# EAGLE schematic cansat_vehicle_v3_brd2 (EAGLE 7.1.0)
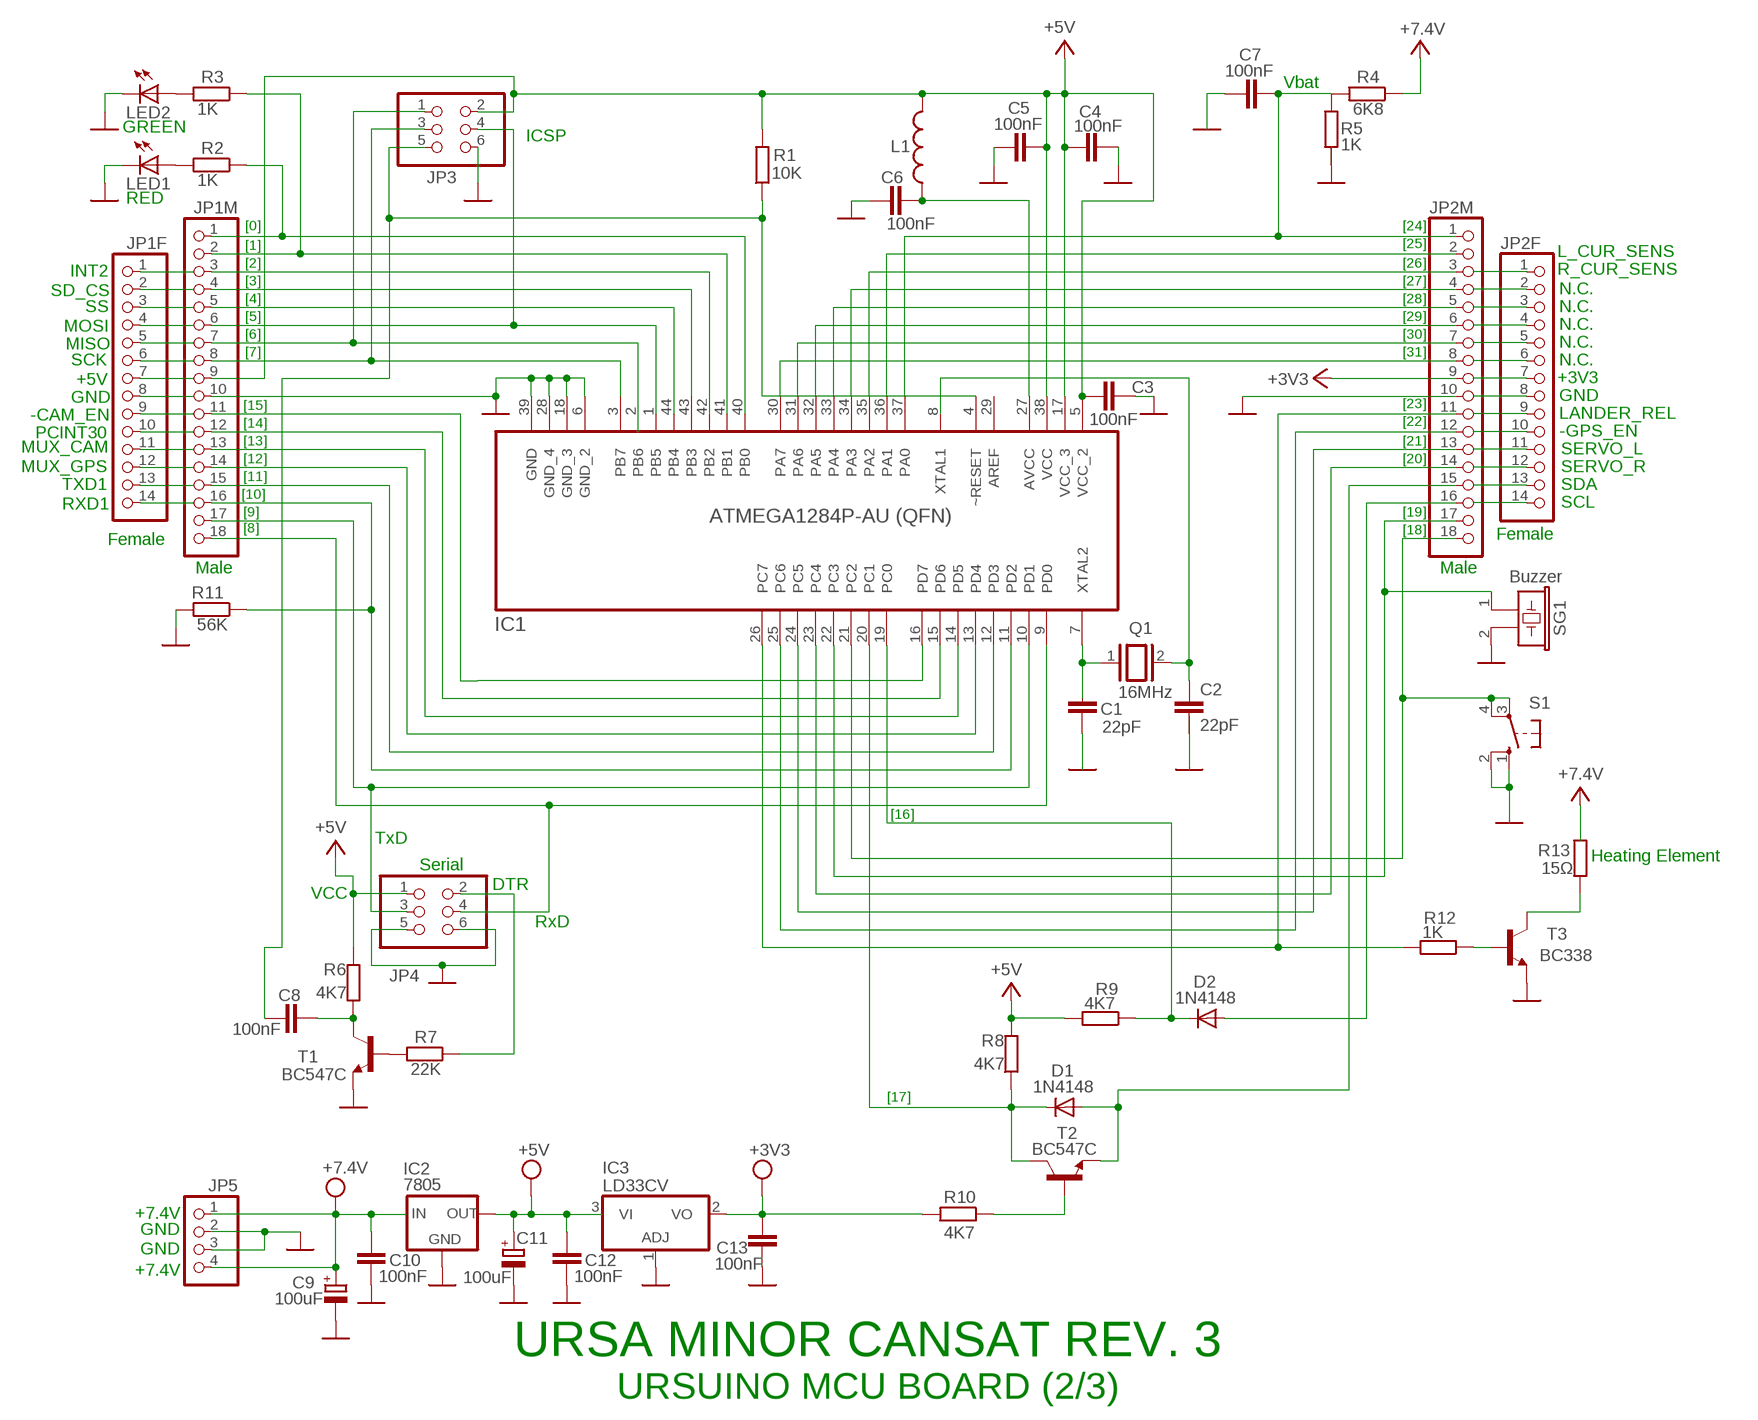
[diagram p0: schematic, sheet 1]

## Parts
C1  22pF  C2.5/2  [C2.5-2]
C2  22pF  C2.5/2  [C2.5-2]
C3  100nF  C2.5/2  [C2.5-2]
C4  100nF  C2.5/2  [C2.5-2]
C5  100nF  C2.5/2  [C2.5-2]
C6  100nF  C2.5/2  [C2.5-2]
C7  100nF  C2.5/2  [C2.5-2]
C8  100nF  C2.5/2  [C2.5-2]
C9  100uF  CPOL-EUE2.5-7  [E2,5-7]
C10  100nF  C2.5/2  [C2.5-2]
C11  100uF  CPOL-EUE2.5-7  [E2,5-7]
C12  100nF  C2.5/2  [C2.5-2]
C13  100nF  C2.5/2  [C2.5-2]
D1  1N4148  1N4148DO35-10  [DO35-10]
D2  1N4148  1N4148DO35-10  [DO35-10]
IC1  ATMEGA1284P-AU (QFN)  ATMEGA1284P-AU  [QFP80P1200X1200X120-44N]
IC2  7805  78XXL  [78XXL]
IC3  LD33CV  317T  [TO220H]
JP1F  PINHD-1X14  [1X14]
JP1M  PINHD-1X18  [1X18]
JP2F  PINHD-1X14  [1X14]
JP2M  PINHD-1X18  [1X18]
JP3  PINHD-2X3  [2X03]
JP4  PINHD-2X3  [2X03]
JP5  PINHD-1X4  [1X04]
L1  L-US0204/5  [0204/5]
LED1  LED3MM  [LED3MM]
LED2  LED3MM  [LED3MM]
Q1  16MHz  XTAL  [Q]
R1  10K  R-EU_0204_2V  [0204V]
R2  1K  R-EU_0204_2V  [0204V]
R3  1K  R-EU_0204_2V  [0204V]
R4  6K8  R-EU_0204_2V  [0204V]
R5  1K  R-EU_0204_2V  [0204V]
R6  4K7  R-EU_0204_2V  [0204V]
R7  22K  R-EU_0204_2V  [0204V]
R8  4K7  R-EU_0204_2V  [0204V]
R9  4K7  R-EU_0204_2V  [0204V]
R10  4K7  R-EU_0204_2V  [0204V]
R11  56K  R-EU_0204_2V  [0204V]
R12  1K  R-EU_0204_2V  [0204V]
R13  15Ω  R-EU_0204_2V  [0204V]
S1  10-XX  [B3F-10XX]
SG1  Buzzer  B/C11L  [B/C11L]
T1  BC547C  BC547B-NPN-TO92-CBE  [TO92-CBE]
T2  BC547C  BC547B-NPN-TO92-CBE  [TO92-CBE]
T3  BC338  BC547B-NPN-TO92-CBE  [TO92-CBE]

## Nets
GND: C1.2 C2.2 C3.2 C4.1 C5.2 C6.1 C9.- C10.2 C11.- C12.2 C13.2 IC1.6(GND_2) IC1.18(GND_3) IC1.28(GND_4) IC1.39(GND) IC2.GND IC3.1(ADJ) JP1M.10 JP2M.10 JP3.6 JP4.5 JP4.6 JP5.2 JP5.3 LED1.K(C) LED2.K(C) R5.1 R11.2 SG1.2 T1.E T3.E
N$1: C1.1 IC1.7(XTAL2) Q1.1
N$2: IC1.15(PD6) JP1M.12
N$4: IC1.14(PD5) JP1M.13
N$5: C2.1 IC1.8(XTAL1) Q1.2
N$6: R12.1 T3.B
N$7: R13.1 T3.C
N$49: IC1.40(PB0) JP1M.1 R2.1
N$50: IC1.41(PB1) JP1M.2 R3.1
N$51: IC1.42(PB2) JP1M.3
N$52: IC1.43(PB3) JP1M.4
N$53: IC1.44(PB4) JP1M.5
N$54: IC1.1(PB5) JP1M.6 JP3.4
N$55: IC1.2(PB6) JP1M.7 JP3.1
N$56: IC1.3(PB7) JP1M.8 JP3.3
N$57: IC1.16(PD7) JP1M.11
N$58: IC1.13(PD4) JP1M.14
N$59: IC1.12(PD3) JP1M.15
N$60: IC1.11(PD2) JP1M.16 R11.1
N$61: IC1.10(PD1) JP1M.17 JP4.3
N$62: R10.1 T2.B
N$63: C7.2
N$64: IC1.36(PA1) JP2M.2
N$65: IC1.35(PA2) JP2M.3
N$66: IC1.34(PA3) JP2M.4
N$67: IC1.33(PA4) JP2M.5
N$68: IC1.32(PA5) JP2M.6
N$69: IC1.31(PA6) JP2M.7
N$70: IC1.30(PA7) JP2M.8
N$71: IC1.21(PC2) JP2M.18 S1.3(P) S1.4(P1)
N$72: IC1.22(PC3) JP2M.17 SG1.1
N$73: D2.A JP2M.16
N$74: D1.C IC1.20(PC1) R8.1 T2.C
N$75: IC1.23(PC4) JP2M.14
N$76: IC1.24(PC5) JP2M.13
N$77: IC1.25(PC6) JP2M.12
N$78: IC1.26(PC7) JP2M.11 R12.2
N$79: JP1F.1
N$80: JP1F.2
N$81: JP1F.3
N$82: JP1F.4
N$83: JP1F.5
N$84: JP1F.6
N$85: JP1F.7
N$86: JP1F.8
N$87: JP1F.9
N$88: JP1F.10
N$89: JP1F.11
N$90: JP1F.12
N$91: JP1F.13
N$92: JP1F.14
N$93: JP2F.1
N$94: D1.A JP2M.15 T2.E
N$95: LED1.A R2.2
N$96: JP2F.2
N$97: D2.C IC1.19(PC0) R9.1
N$98: JP2F.3
N$99: JP2F.4
N$100: JP2F.5
N$101: JP2F.6
N$102: JP2F.7
N$103: JP2F.8
N$104: JP2F.9
N$105: JP2F.10
N$106: JP2F.11
N$107: JP2F.12
N$108: JP2F.13
N$109: JP2F.14
N$110: C6.2 IC1.27(AVCC) L1.1
N$111: C8.1 IC1.4(~RESET) JP3.5 R1.1
N$112: LED2.A R3.2
N$113: S1.1(S) S1.2(S1)
N$114: C7.1 IC1.37(PA0) JP2M.1 R4.2 R5.2
N$115: C8.2 R6.1 T1.C
N$116: R7.2 T1.B
N$117: JP4.2 R7.1
N$119: IC1.9(PD0) JP1M.18 JP4.4
VCC: C3.1 C4.2 C5.1 C9.+ C10.1 C11.+ C12.1 C13.1 IC1.5(VCC_2) IC1.17(VCC_3) IC1.38(VCC) IC2.IN IC2.OUT IC3.2(VO) IC3.3(VI) JP1M.9 JP2M.9 JP3.2 JP4.1 JP5.1 JP5.4 L1.2 R1.2 R4.1 R6.2 R8.2 R9.2 R10.2 ; supply symbol labelled +5V, +7.4V, +3V3
Unconnected: IC1.29(AREF) R13.2

## Notes on the sheet
- Vbat
- GREEN
- ICSP
- RED
- [0] | [24]
- [1] | [25]
- L_CUR_SENS
- INT2 | [2] | [26]
- R_CUR_SENS
- SD_CS | [3] | [27]
- N.C.
- [4] | [28]
- SS | N.C.
- [5] | [29]
- MOSI | N.C.
- [6] | [30]
- MISO | N.C.
- [7] | [31]
- SCK | N.C.
- +5V | +3V3
- GND | GND
- [15] | [23]
- -CAM_EN | LANDER_REL
- [14] | [22]
- PCINT30 | -GPS_EN
- [13] | [21]
- MUX_CAM | SERVO_L
- [12] | [20]
- MUX_GPS | SERVO_R
- [11]
- TXD1 | SDA
- [10]
- RXD1 | SCL
- [9] | [19]
- Female
- Female | [8] | [18]
- Male | Male
- [16]
- TxD
- Heating Element
- Serial
- DTR
- VCC
- RxD
- [17]
- +7.4V
- GND
- GND
- +7.4V
- URSA MINOR CANSAT REV. 3
- URSUINO MCU BOARD (2/3)

## Library data of the parts
C1-C8 C10 C12 C13 = capacitor-wima:C: CAPACITOR naming: grid - package width
C9 C11 = rcl:CPOL-EU: POLARIZED CAPACITOR, European symbol
D1 D2 = diode:1N4148: DIODE high speed (Philips)
IC1 = Atmel_By_element14_Batch_1-00:ATMEGA1284P-AU: Microcontroller with Programmable Flash; MPN: ATMEGA1284P-AU; OC_FARNELL: 1715480; OC_NEWARK: 15R0263; PACKAGE: TQFP-44; SUPPLIER: Atmel
IC2 = v-reg:78XXL: VOLTAGE REGULATOR
IC3 = linear:*317: Positive VOLTAGE REGULATOR
JP1F JP2F = pinhead:PINHD-1X14: PIN HEADER
JP1M JP2M = pinhead:PINHD-1X18: PIN HEADER
JP3 JP4 = pinhead:PINHD-2X3: PIN HEADER
JP5 = pinhead:PINHD-1X4: PIN HEADER
L1 = rcl:L-US: INDUCTOR, American symbol
LED1 LED2 = led:LED: LED OSRAM: - CHIPLED LG R971, LG N971, LY N971, LG Q971, LY Q971, LO R971, LY R971 LH N974, LH R974 LS Q976, LO Q976, LY Q976 LO Q996 - Hyper CHIPLED LW Q18S LB Q993, LB Q99A, LB R99A - SideLED LS A670, LO A670, LY A670, LG A670, LP A670 LB A673, LV A673, LT A673, LW A673 LH A674 LY A675 LS A676, LA A676, LO A676, LY A676, LW A676 LS A679, LY A679, LG A679 - Hyper Micro SIDELED® LS Y876, LA Y876, LO Y876, LY Y876 LT Y87S - SmartLED LW L88C, LW L88S LB L89C, LB L89S, LG L890 LS L89K, LO L89K, LY L89K LS L896, LA L896, LO L896, LY L896 - TOPLED LS T670, LO T670, LY T670, LG T670, LP T670 LSG T670, LSP T670, LSY T670, LOP T670, LYG T670 LG T671, LOG T671, LSG T671 LB T673, LV T673, LT T673, LW T673 LH T674 LS T676, LA T676, LO T676, LY T676, LB T676, LH T676, LSB T676, LW T676 LB T67C, LV T67C, LT T67C, LS T67K, LO T67K, LY T67K, LW E67C LS E67B, LA E67B, LO E67B, LY E67B, LB E67C, LV E67C, LT E67C LW T67C LS T679, LY T679, LG T679 LS T770, LO T770, LY T770, LG T770, LP T770 LB T773, LV T773, LT T773, LW T773 LH T774 LS E675, LA E675, LY E675, LS T675 LS T776, LA T776, LO T776, LY T776, LB T776 LHGB T686 LT T68C, LB T68C - Hyper Mini TOPLED® LB M676 - Mini TOPLED Santana® LG M470 LS M47K, LO M47K, LY M47K Source: http://www.osram.convergy.de LUXEON: - LUMILED® LXK2-PW12-R00, LXK2-PW12-S00, LXK2-PW14-U00, LXK2-PW14-V00 LXK2-PM12-R00, LXK2-PM12-S00, LXK2-PM14-U00 LXK2-PE12-Q00, LXK2-PE12-R00, LXK2-PE12-S00, LXK2-PE14-T00, LXK2-PE14-U00 LXK2-PB12-K00, LXK2-PB12-L00, LXK2-PB12-M00, LXK2-PB14-N00, LXK2-PB14-P00, LXK2-PB14-Q00 LXK2-PR12-L00, LXK2-PR12-M00, LXK2-PR14-Q00, LXK2-PR14-R00 LXK2-PD12-Q00, LXK2-PD12-R00, LXK2-PD12-S00 LXK2-PH12-R00, LXK2-PH12-S00 LXK2-PL12-P00, LXK2-PL12-Q00, LXK2-PL12-R00 Source: www.luxeon.com KINGBRIGHT: KA-3528ASYC Source: www.kingbright.com
Q1 = special:XTAL: CRYSTAL
R1-R13 = resistor:R-EU_: RESISTOR, European symbol; SPICEPREFIX: R
S1 = switch-omron:10-XX: OMRON SWITCH; MPN: B3F-1000; OC_FARNELL: 176432; OC_NEWARK: 36M3542
SG1 = buzzer:B/C11L: BUZZER Source: Buerklin; OC_FARNELL: unknown; OC_NEWARK: unknown
T1-T3 = transistor:*-NPN-: NPN Transistror BF959 corrected 2008.03.06